# Altium project ESP32_DevKit.PrjPcb
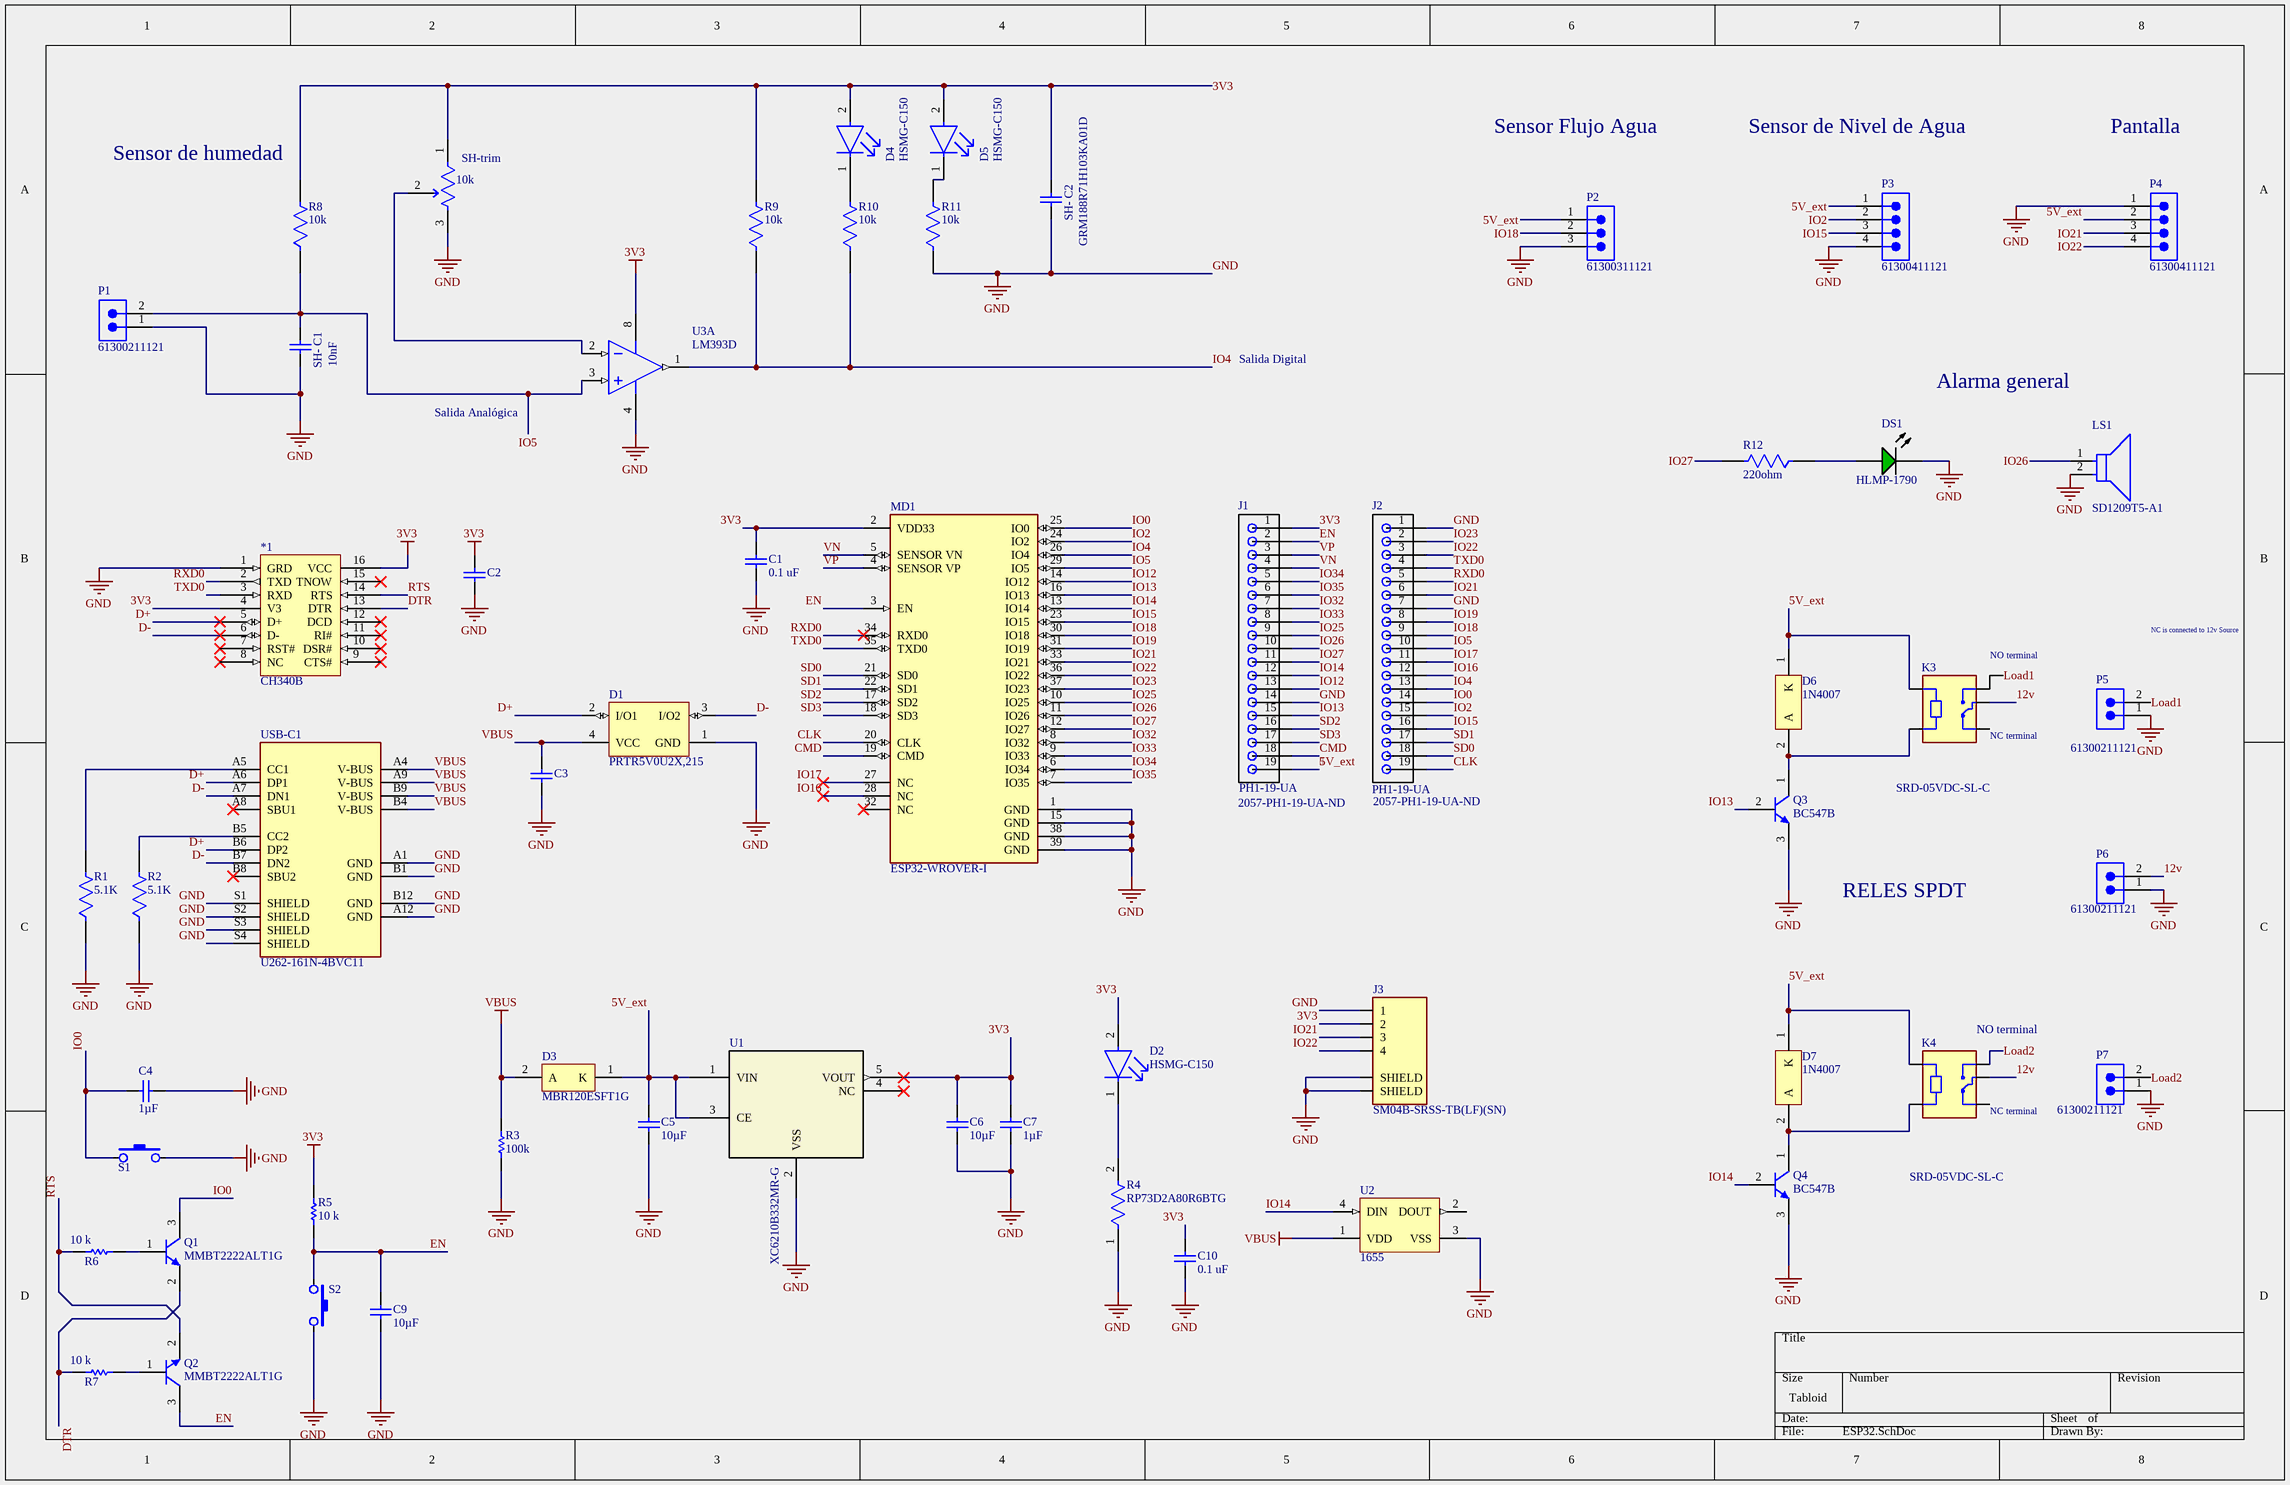
[diagram p0: ESP32.SchDoc]
1 sheet, 57 parts. Net scope: global (net labels, ports and power ports of the same name join across sheets).
Board files: stencil.PcbDoc, PCB1-ESP.PcbDoc

## Sheet ESP32.SchDoc
size Tabloid; SheetNumber: 1; SheetTotal: 1

### Parts
*1  CH340B  [CH340B]
C1  0.1 uF  [CAPC2013X94X50ML20T25]
C2  08055C104KAT2A  [CAPC2013X94X50ML20T25]  (value not drawn)
C3  08055C104KAT2A  [CAPC2013X94X50ML20T25]  (value not drawn)
C4  1µF  [CAPC2013X145X50ML20T25]
C5  10µF  [CAPC2013X140X50ML20T25]
C6  10µF  [CAPC2013X140X50ML20T25]
C7  1µF  [CAPC2013X145X50ML20T25]
C9  10µF  [CAPC2013X145X50ML20T25]
C10  0.1 uF  [CAPC2013X94X50ML20T25]
D1  PRTR5V0U2X,215  [NXP-SOT143B-4_V]
D2  HSMG-C150  [FP-HSMG-C150-MFG]
D3  MBR120ESFT1G  [ONSC-SOD-123FL-2-498_V]
D4  HSMG-C150  [FP-HSMG-C150-MFG]
D5  HSMG-C150  [FP-HSMG-C150-MFG]
D6  1N4007  [ONSC-AXIAL_LEAD-2-59-10_P]
D7  1N4007  [ONSC-AXIAL_LEAD-2-59-10_P]
DS1  HLMP-1790  [LED-2P-2.54-3MM_V]
J1  PH1-19-UA  Supplier Part Number 1: 2057-PH1-19-UA-ND  [PH1-19-UA]
J2  PH1-19-UA  Supplier Part Number 1: 2057-PH1-19-UA-ND  [PH1-19-UA]
J3  SM04B-SRSS-TB(LF)(SN)  [JST_SM04B-SRSS-TB(LF)(SN)]
K3  SRD-05VDC-SL-C  [RELAY_SRD-05VDC-SL-C]
K4  SRD-05VDC-SL-C  [RELAY_SRD-05VDC-SL-C]
LS1  SD1209T5-A1  [FP-SD1209-MFG]
MD1  ESP32-WROVER-I  [FP-ESP32-WROVER-I-MFG]
P1  61300211121  [61300211121]
P2  61300311121  [61300311121]
P3  61300411121  [61300411121]
P4  61300411121  [61300411121]
P5  61300211121  [61300211121]
P6  61300211121  [61300211121]
P7  61300211121  [61300211121]
Q1  MMBT2222ALT1G  [ONSC-SOT-23-3-318-08_V]
Q2  MMBT2222ALT1G  [ONSC-SOT-23-3-318-08_V]
Q3  BC547B  [ONSC-TO-92-3-29-11]
Q4  BC547B  [ONSC-TO-92-3-29-11]
R1  5.1K  [FP-CRCW0805-e3-MFG]
R2  5.1K  [FP-CRCW0805-e3-MFG]
R3  100k  [RESC2013X60X40ML20T25]
R4  RP73D2A80R6BTG  [FP-RP732A-MFG]
R5  10 k  [RESC2013X60X30ML20T20]
R6  10 k  [RESC2013X60X30ML20T20]
R7  10 k  [RESC2013X60X30ML20T20]
R8  10k  [FP-CRCW0805-e3-MFG]
R9  10k  [FP-CRCW0805-e3-MFG]
R10  10k  [FP-CRCW0805-e3-MFG]
R11  10k  [FP-CRCW0805-e3-MFG]
R12  220ohm  [FP-CRCW0805-e3-MFG]
S1  IO0  [SMT_SW_PTS_820]  (value not drawn)
S2  PTS820J25MSMTRLFS  [SMT_SW_PTS_820]  (value not drawn)
SH-_C1  10nF  [CAPC1608X90X35ML10T15]
SH-_C2  GRM188R71H103KA01D  [CAPC1608X90X35ML10T15]
SH-trim  10k  [FP-3362P-1-102TLF-MFG]
U1  XC6210B332MR-G  [SOT-25_TOR-M]
U2  1655  [ADA-RGB-1655_V]
U3  LM393D  [D0008A_M]  (part A of 2)
USB-C1  U262-161N-4BVC11  [U262-161N-4BVC11]

### Nets
3V3: *1.4(V3) *1.16(VCC) C1.2 C2.2 C6.2 C7.2 C10.2 D2.2(A) D4.2(A) D5.2(A) J1.1 J3.2 MD1.2(VDD33) R5.2 R8.2 R9.2 SH-_C2.2 SH-trim.1(CCW) U1.5(VOUT) U3.8(VCC)
GND: *1.1(GRD) C1.1 C2.1 C3.1 C4.1 C5.1 C6.1 C7.1 C9.1 C10.1 D1.1(GND) DS1.2(K) J1.14 J2.1 J2.7 J3.1 J3.S1(SHIELD) J3.S2(SHIELD) LS1.2(A) MD1.1(GND) MD1.15(GND) MD1.38(GND) MD1.39(GND) P1.1 P2.3 P3.4 P4.1 P5.1 P6.1 P7.1 Q3.3(E) Q4.3(E) R1.1 R2.1 R3.1 R4.1 R11.1 S1.2 S2.2 SH-_C1.1 SH-_C2.1 SH-trim.3(CW) U1.2(VSS) U2.3(VSS) U3.4(GND) USB-C1.A1(GND) USB-C1.A12(GND) USB-C1.B1(GND) USB-C1.B12(GND) USB-C1.S1(SHIELD) USB-C1.S2(SHIELD) USB-C1.S3(SHIELD) USB-C1.S4(SHIELD)
VBUS: C3.2 D1.4(VCC) D3.2(A) R3.2 U2.1(VDD) USB-C1.A4(V-BUS) USB-C1.A9(V-BUS) USB-C1.B4(V-BUS) USB-C1.B9(V-BUS)
12v: K3.COM K4.COM P6.2
: C5.2 D3.1(K) D6.1(K) D7.1(K) J1.19 K3.A1 K4.A1 P2.1 P3.1 P4.2 U1.1(VIN) U1.3(CE)  [also labelled 5V_ext]
CLK: J2.19 MD1.20(CLK)
CMD: J1.18 MD1.19(CMD)
D+: *1.5(D+) D1.2(I/O1) USB-C1.A6(DP1) USB-C1.B6(DP2)
D-: *1.6(D-) D1.3(I/O2) USB-C1.A7(DN1) USB-C1.B7(DN2)
DTR: *1.13(DTR) Q1.2(E) R7.2
EN: C9.2 J1.2 MD1.3(EN) Q2.3(C) R5.1 S2.1
IO0: C4.2 J2.14 MD1.25(IO0) Q1.3(C) S1.1
IO2: J2.15 MD1.24(IO2) P3.2
IO4: J2.13 MD1.26(IO4) R9.1 R10.1 U3.1(1OUT)
IO5: J2.10 MD1.29(IO5) P1.2 R8.1 SH-_C1.2 U3.3(1IN+)
IO12: J1.13 MD1.14(IO12)
IO13: J1.15 MD1.16(IO13) Q3.2(B)
IO14: J1.12 MD1.13(IO14) Q4.2(B) U2.4(DIN)
IO15: J2.16 MD1.23(IO15) P3.3
IO16: J2.12 MD1.28(NC)
IO17: J2.11 MD1.27(NC)
IO18: J2.9 MD1.30(IO18) P2.2
IO19: J2.8 MD1.31(IO19)
IO21: J2.6 J3.3 MD1.33(IO21) P4.3
IO22: J2.3 J3.4 MD1.36(IO22) P4.4
IO23: J2.2 MD1.37(IO23)
IO25: J1.9 MD1.10(IO25)
IO26: J1.10 LS1.1(C) MD1.11(IO26)
IO27: J1.11 MD1.12(IO27) R12.2
IO32: J1.7 MD1.8(IO32)
IO33: J1.8 MD1.9(IO33)
IO34: J1.5 MD1.6(IO34)
IO35: J1.6 MD1.7(IO35)
Load1: K3.NO P5.2
Load2: K4.NO P7.2
RTS: *1.14(RTS) Q2.2(E) R6.2
RXD0: *1.2(TXD) J2.5 MD1.34(RXD0)
SD0: J2.18 MD1.21(SD0)
SD1: J2.17 MD1.22(SD1)
SD2: J1.16 MD1.17(SD2)
SD3: J1.17 MD1.18(SD3)
TXD0: *1.3(RXD) J2.4 MD1.35(TXD0)
VN: J1.4 MD1.5(SENSOR_VN)
VP: J1.3 MD1.4(SENSOR_VP)
NetD2_1: D2.1(C) R4.2
NetD4_1: D4.1(C) R10.2
NetD5_1: D5.1(C) R11.2
NetD6_2: D6.2(A) K3.A2 Q3.1(C)
NetD7_2: D7.2(A) K4.A2 Q4.1(C)
NetDS1_1: DS1.1(A) R12.1
NetQ1_1: Q1.1(B) R6.1
NetQ2_1: Q2.1(B) R7.1
NetR1_2: R1.2 USB-C1.A5(CC1)
NetR2_2: R2.2 USB-C1.B5(CC2)
NetSH-trim_2: SH-trim.2(WIPER) U3.2(1IN-)

Not connected (* = marked no-connect by the designer): *1 7(RST#)* 8(NC)* 9(CTS#)* 10(DSR#)* 11(RI#)* 12(DCD)* 15(TNOW)*; K3 NC; K4 NC; MD1 32(NC)*; U1 4(NC)*; U2 2(DOUT); USB-C1 A8(SBU1)* B8(SBU2)*

### Notes on the sheet
- (near R8) Sensor de humedad
- Sensor Flujo Agua
- Sensor de Nivel de Agua
- Pantalla
- Salida Digital
- Salida Analógica
- Alarma general
- NC is connected to 12v Source
- (near K3) NO terminal
- (near K3) NC terminal
- RELES SPDT
- (near K4) NO terminal
- (near K4) NC terminal

### Library data of the parts
*1 = CH340B: - USB 2.0 Transceiver 2Mbps SOP-16_150mil USB ICs ROHS; ComponentLink1Description: Datasheet; ComponentLink1URL: https://www.mpja.com/download/35227cpdata.pdf
C1-C3 C10 = CMP-2000-05016-1: Chip Capacitor, Ceramic, 0.1 uF, 10%, 50 V, 0805, RoHS, Tape and Reel; Manufacturer: AVX; Rated Voltage: 50V; Capacitance: 100nF; Dielectric: X7R; Case Size/Dimension: 0805; Tolerance (%): ±10%; Datasheet URL: http://www.farnell.com/datasheets/319609.pdf; Datasheet Version: Sep-07; Manufacturer URL: http://www.avx.com/
C4 C7 C9 = CMP-2007-01082-1: 1µF ±10% 16V Ceramic Capacitor X7R 0805 (2012 Metric); Manufacturer: Kemet; Part Number: C0805C105K4RAC7800
C5 C6 = CMP-2007-03242-1: 10µF ±10% 16V Ceramic Capacitor X5R 0805 (2012 Metric); Part Number: CL21A106KOQNNNG
D1 = CMP-2000-05285-1: Ultra Low Capacitance Double Rail-to-Rail ESD Protection Diode, 5.5 V, 1 pF, -40 to 85 degC, 4-Pin SOT143B, RoHS, Tape and Reel; Manufacturer: NXP Semiconductors; Capacitance Value: 16pF; Number of Elements: 1; Rad Hardened: No; Reverse Breakdown Voltage: 6V; Working Voltage (Max): 5.5V; Polarity: Uni-Directional; Configuration: Quad; Leakage Current: 0.1uA; Product Height (mm): 1mm; Suppressor Type: DiodeArrays; Product Length (mm): 3mm; Product Depth (mm): 1.4mm; ESD Protection Voltage: 8KV@ContactDisc; Package Type: SOT; Mounting: SurfaceMount; Packaging: TapeandReel; Datasheet Version: Rev. 02, 01/2008; Reverse Stand-off Voltage: 5.5V; Manufacturer URL: http://www.nxp.com/; Operating Temp Range: -40Cto85C; Operating Temperature Classification: Industrial; Working Voltage: 5.5V; Operating Temperature Min Deg. C: -40C; Datasheet URL: https://datasheet.ciiva.com/4479/prtr5v0u2x-102853-4479461.pdf; Leakage Current (Max): 0.1uA; Direction Type: Uni-Directional; Pin Count: 3+Tab; Operating Temperature Max Deg. C: 85C; Mounting Style: SurfaceMount; Package / Case: SOT
D2 D4 D5 = CMP-2000-05061-2: LED GREEN DIFFUSED 1206 SMD; Manufacturer: Broadcom; Led Orientation: Top View; Max Junction Temp: +95°C; Peak Emmision Wavelength: 570nm; Viewing Angle: 170°; Wavelength: 572nm; Reverse Voltage: 5V; Luminous Intensity: 15mcd; Forward Voltage: 2.2V; Power Dissipation: 65mW; Forward Current: 20mA; ComponentLink2Description: Datasheet; Lead Free: Yes; Temperature Range Low: -40°C; Package: HSMG-C150; Digikey Description: LED GREEN DIFFUSED 1206 SMD; Mouser Description: LED Uni-Color Green 570nm 2-Pin Chip LED T/R; Manufacturer Part Number: HSMG-C150; Temperature Range High: +85°C; Device Class L1: Optoelectronics; Colour: Green; Category: Diode; Device Class L3: unset; RoHS: TRUE; Height: 1.2mm; ComponentLink2URL: https://docs.broadcom.com/docs/AV02-0551EN; Device Class L2: LEDs; Automotive: No; Ipc Land Pattern Name: DIOCP320160X55; Octopart: https://octopart.com/hsmg-c150-broadcom-71131304; Temperature: -40°C to +85°C
D3 = CMP-1055-00434-1: Schottky Power Rectifier, 2-Pin SOD-123, Pb-Free, Tape and Reel; Manufacturer: On Semiconductor; Configuration: Single; IFSM Max (A): 40; ComponentLink2URL: http://www.onsemi.cn/pub_link/Collateral/MBR120ESFT1-D.PDF; PackageDescription: 2-Pin SOD, Body 1.65 x 2.7 mm; RoHS: TRUE; ComponentLink1URL: http://www.onsemi.com/; PackageVersion: Rev. D, 05/2013; PartNumber: MBR120ESFT1G; PackageReference: SOD-123FL-2-498; ComponentLink2Description: Datasheet; ComponentLink1Description: Manufacturer URL; DatasheetVersion: Rev. 4; ComponentLink3Description: Package Specification; ComponentLink3URL: http://www.onsemi.com/pub_link/Collateral/498-01.PDF; Mounting Technology: Surface Mount; Packing: Tape and Reel
D6 D7 = CMP-0902-00142-1: Standard Recovery Rectifier, 2-Pin Axial_Lead, Pb-Free, Bulk Bag; Manufacturer: On Semiconductor; IO(rec) Max (A): 1; IFSM Max (A): 30; VRRM Max (V): 1000; ComponentLink3URL: http://www.onsemi.cn/pub_link/Collateral/59-10.PDF; PackageVersion: Rev. U, 02/2005; PackageDescription: 2-Pin, Axial Lead, Diameter 2.35 mm; PackageReference: AXIAL_LEAD-2-59-10; RoHS: TRUE; PartNumber: 1N4007; Packing: Bulk Bag; DatasheetVersion: Rev. 13; ComponentLink3Description: Package Specification; ComponentLink1Description: Manufacturer URL; ComponentLink2URL: http://www.onsemi.com/pub_link/Collateral/1N4001-D.PDF; ComponentLink1URL: http://www.onsemi.com/; Type: Standard Recovery; ComponentLink2Description: Datasheet; Mounting Technology: Through Hole
DS1 = CMP-2000-05186-1: LED, Green, 2 mA, 1.9 V, -20 to 100 degC, 2-Pin THD, RoHS, Bulk; Manufacturer: Avago; Viewing Angle: 50deg; Number of LEDs: 1; Lens Appearance: ColoredDiffused; Peak Wavelength: 565nm; Dominant Wavelength/Color Temperature: 569nm; Mounting Orientation: TopMount; Rad Hard: No; Lens Shape Type: Circular; Type: Uni-Color; Intensity: 2.3mcd; Package: 2T-1; Packaging: Bulk; Pin Count: 2; Color: Green; Datasheet URL: https://datasheet.ciiva.com/11773/0900766b800204ad-11773539.pdf; Manufacturer URL: http://www.avagotech.com/; Category: LEDs; Mounting: ThroughHole; Datasheet Version: Jul-14
J1 J2 = PH1-19-UA: Connector Header Through Hole 19 position 0.100" (2.54mm); Supplier 1: Digi-Key
J3 = SM04B-SRSS-TB(LF)(SN): Connector Header Surface Mount, Right Angle 4 position 0.039 _1.00mm_; MF: JST Sales; MP: SM04B-SRSS-TB_LF__SN_; Price: None; SnapEDA_Link: https://www.snapeda.com/parts/SM04B-SRSS-TB%28LF%29%28SN%29/JST%20Sales%20America%20Inc./view-part/557466/?ref=snap; Value: *; Availability: Unavailable; Package: None
K3 K4 = SRD-05VDC-SL-C: 5V Trigger Relay Module For Arduino And Raspberry Pi 5V Trigger Relay Module For Arduino And Raspberry Pi; MF: Songle Relay; Check_prices: https://www.snapeda.com/parts/SRD-05VDC-SL-C/Songle+Relay/view-part/?ref=eda; Value: *; Availability: Not in stock; Price: None; Package: NON STANDARD-5 Songle Relay; MP: SRD-05VDC-SL-C; SnapEDA_Link: https://www.snapeda.com/parts/SRD-05VDC-SL-C/Songle+Relay/view-part/?ref=snap
LS1 = CMP-08413-000009-1: AUDIO MAGNETIC XDCR 3-6V TH; Max Supply Current: 60mA; Number of Terminals/Pins: 2; Frequency: 2.048kHz; Washable: No; Operating Supply Voltage: 5V; Self Resonant Frequency: 2.05kHz; Min Operating Temperature: -40°C; Operating Supply Current: 60mA; Diameter: 12mm; Package Quantity: 100; Max Operating Temperature: 85°C; Sensing Method: Magnetic; Series: SD; Current Rating: 60mA; Lead Free: Lead Free; Height: 9mm; Packaging: Tray; Termination: PC Pins; Number of Pins: 2; Voltage Rating (DC): 5V; Mount: Through Hole
MD1 = CMP-194065-000001-1: SMD MODULE, ESP32-D0WDQ6, 32MBIT; Manufacturer: Espressif; Number Of Adc Channels: 16; Min Supply Voltage: 2.3V; Interface: I2C,SPI,UART,I2S,Other; Max Frequency: 2484MHz; Nominal Supply Current: 500mA; Sensitivity: -98dBm; Max Supply Voltage: 3.6V; Number Of Gpio: 20; Data Rate: 150Mbits/s; Package: ESP32-WROVER-I; Temperature Range Low: -40°C; Temperature Range High: +85°C; Device Class L1: Integrated Circuits (ICs); Category: UNK; ComponentLink2Description: Datasheet; Device Class L2: RF Semiconductors and Devices; Automotive: No; Lead Free: Yes; Octopart: https://octopart.com/esp32-wrover-i-espressif+systems-89171349; ComponentLink2URL: https://www.espressif.com/sites/default/files/documentation/esp32-wrover_datasheet_en.pdf; Temperature: -40°C to +85°C; Height: 3.4mm; RoHS: TRUE; Digikey Description: SMD MODULE, ESP32-D0WDQ6, 32MBIT; Device Class L3: Transceivers; Manufacturer Part Number: ESP32-WROVER-I
P1 P5-P7 = CMP-1712-00002-6: NexarPartId: 20081794; Number of Contacts: 2; Pitch: 2.54mm; Connector Type: Male Pin; Voltage Rating: 250V; Current Rating: 3A; Gender: Male; Contact Resistance: 20mΩ; Height: 8.94mm; Lead Free: Lead Free; Number of Pins: 2; Termination: Through Hole; RoHS: Compliant; Lead Pitch: 2.54mm; REACH SVHC: No SVHC; Housing Material: PBT; Contact Mating Length: 5.9944mm; Min Operating Temperature: -40°C; Orientation: Vertical; Contact Material: Copper; Contact Gender: Male; Max Operating Temperature: 125°C; Number of Rows: 1; Number of Positions: 2; Packaging: Bulk; Contact Plating: Gold; Mount: Through Hole; Color: Black; Operating Supply Voltage: 250V
P2 = CMP-1502-01062-3: NexarPartId: 32855521; Current Rating: 3A; Voltage Rating: 250V; Number of Positions: 3; Pitch: 2.54mm; Contact Resistance: 20mΩ; Connector Type: Male Pin; Gender: Male; REACH SVHC: Unknown; Packaging: Bulk; Contact Material: Copper; Min Operating Temperature: -40°C; Number of Rows: 1; Orientation: Vertical; RoHS: Compliant; Contact Plating: Gold; Max Operating Temperature: 105°C; Mount: Through Hole; Height: 8.94mm; Operating Supply Voltage: 250V; Number of Pins: 3; Contact Mating Length: 5.9944mm; Number of Contacts: 3; Color: Black; Lead Free: Lead Free; Lead Pitch: 2.54mm; Termination: Solder
P3 P4 = CMP-1502-01064-3: NexarPartId: 32855522; Operating Supply Voltage: 250V; Pitch: 2.54mm; Contact Resistance: 20mΩ; Number of Positions: 4; Current Rating: 3A; Connector Type: Male Pin; Gender: Male; Contact Plating: Gold; Height: 8.89mm; Lead Pitch: 2.54mm; Lead Free: Lead Free; Contact Mating Length: 5.9944mm; Number of Rows: 1; Termination: Solder; Packaging: Bulk; REACH SVHC: Unknown; Min Operating Temperature: -40°C; RoHS: Compliant; Number of Contacts: 4; Voltage Rating: 250V; Color: Black; Max Operating Temperature: 105°C; Contact Material: Copper; Mount: Through Hole; Orientation: Vertical; Number of Pins: 4
Q1 Q2 = CMP-1048-00538-1: General Purpose Transistor, NPN Silicon, 3-Pin SOT-23, Pb-Free, Tape and Reel; Manufacturer: On Semiconductor; fT Min (MHz): 300; IC Continuous (A): 0.6; ComponentLink3URL: http://www.onsemi.cn/pub_link/Collateral/318-08.PDF; PartNumber: MMBT2222ALT1G; RoHS: TRUE; ComponentLink1URL: http://www.onsemi.com/; ComponentLink3Description: Package Specification; ComponentLink2Description: Datasheet; Mounting Technology: Surface Mount; Packing: Tape and Reel; PackageDescription: 3-Pin Small Outline Transistor, Body 2.92 x 1.3 mm, Pitch 0.95 mm; DatasheetVersion: Rev. 10; PackageReference: SOT-23-3-318-08; ComponentLink2URL: http://www.onsemi.cn/pub_link/Collateral/MMBT2222LT1-D.PDF; Polarity: NPN; PackageVersion: Rev. AP, 11/2009; ComponentLink1Description: Manufacturer URL
Q3 Q4 = CMP-1048-01467-1: Amplifier Transistor, NPN Silicon, 3-Pin TO-92, Bulk Box; Manufacturer: On Semiconductor; IC Continuous (A): 0.1; fT Min (MHz): 150; DatasheetVersion: Rev. 7; ComponentLink1URL: http://www.onsemi.com/; Polarity: NPN; RoHS: FALSE; ComponentLink1Description: Manufacturer URL; Packing: Bulk Box; PackageDescription: 3-Pin Transistor Outline, Body 4.825 x 3.685 mm, Pitch 1.27 mm; ComponentLink3URL: http://www.onsemi.cn/pub_link/Collateral/2N6426-D.PDF; ComponentLink2Description: Datasheet; PackageVersion: Rev. AM; PackageReference: TO-92-3-29-11_AM_SL; ComponentLink3Description: Package Specification; Mounting Technology: Through Hole; PartNumber: BC547B; ComponentLink2URL: http://www.onsemi.com/pub_link/Collateral/BC546-D.PDF
R1 R2 R8-R12 = CMP-2001-04024-2: RES Thick Film, 5.1kΩ, 1%, 0.125W, 100ppm/°C, 0805; Power Rating: 125mW; Voltage Rating (DC): 150V; Resistance: 5.1kR; Packaging: Tape and Reel; Case Code (Metric): 2012; Contact Plating: Tin; Case Code (Imperial): 0805; Depth: 1.25mm; Tolerance: 1%; Width: 0.049inch; Temperature Coefficient: 100ppm/°C; Max Power Dissipation: 125mW; Military Standard: Not; Lead Free: Lead Free; Mount: Surface Mount; Min Operating Temperature: -55°C; Package Quantity: 10; Weight: 0.000194oz; Height: 0.45mm; Number of Terminations: 2; Max Operating Temperature: 155°C; Termination: SMD/SMT; Case/Package: 0805; Composition: Thick Film; Voltage Rating: 150V; Length: 2mm; Features: Automotive AEC-Q200; Radiation Hardening: No
R3 = CMP-2001-00583-1: 100 kOhms ±0.1% 0.125W, 1/8W Chip Resistor 0805 (2012 Metric) Automotive AEC-Q200 Thin Film; Part Number: ERA6AEB104V; Manufacturer: Panasonic
R4 = CMP-03211-002377-1: RESISTOR, 0805 80.6Ω, 0.1% 15ppm/°C; Manufacturer: TE Connectivity; Power Rating: 0.125W; Voltage Rating: 150V; ComponentLink2URL: https://www.te.com/commerce/DocumentDelivery/DDEController?Action=srchrtrv&DocNm=1773272&DocType=DS&DocLang=English; Device Class L3: Chip SMD Resistors; Automotive: No; ComponentLink2Description: Datasheet; Series: RP73; Temperature Coefficient: 15ppm/°C; Octopart: https://octopart.com/rp73d2a80r6btg-te+connectivity-42011633; octopart_url: https://octopart.com/rp73d2a80r6btg-te+connectivity-42011633; Device Class L2: Resistors; Device Class L1: Passive Components; Value: 80.6Ω; Composition: Thin Film; Lead Free: Yes; Ipc Land Pattern Name: RESC200125X55; Resistance: 80.6Ω; Package: RP732A; packaging: 250 cut tape length; Height: 0.65mm; Tolerance: 0.1%; Manufacturer Part Number: RP73D2A80R6BTG; Temperature: -55°C to 155°C; Temperature Range High: 155°C; RoHS: TRUE; Category: Res; Temperature Range Low: -55°C
R5-R7 = CMP-2001-04657-1: 10 kOhms ±5% 0.25W, 1/4W Chip Resistor 0805 (2012 Metric) Automotive AEC-Q200, Moisture Resistant Thick Film; Part Number: RK73B2ATTD103J; Manufacturer: KOA Speer
S1 = PTS820J25MSMTRLFS
SH-_C1 = CMP-2100-03642-1: Chip Capacitor, 10 nF, +/- 10%, 50 V, -55 to 125 degC, 0603 (1608 Metric), RoHS, Tape and Reel; Manufacturer: Murata; Insulation Resistance: 10GR; Dielectric: X7R; Voltage Rating: 50V; Dielectric Material: Ceramic; Package Quantity: 1; Lead Free: LeadFree; Case/Package: 0603; Termination: SMD/SMT; REACH SVHC: Unknown; Manufacturer URL: http://www.murata.com/; Datasheet URL: http://search.murata.co.jp/Ceramy/image/img/A01X/G101/ENG/GRM188R71H103KA01-01.pdf; Mount: SurfaceMount; Datasheet Version: 42401.0; Number of Pins: 2; Length: 1.6mm; Voltage: 50V; Depth: 0.8mm; Tolerance: 10%; Min Operating Temperature: -55degC; Voltage Rating (DC): 50V; Max Operating Temperature: 125degC; Package Description: 2-Pin Surface Mount Device, Body 1.6 x 0.8 mm; RoHSCompliant: True; Case Code (Imperial): 0603; Width: 0.031inch; Case Code (Metric): 1608; Height: 0.8mm; Package Reference: 0603; Packaging: TapeandReel; Thickness: 0.035inch; Capacitance: 10nF; Material: Ceramic
SH-_C2 = CMP-2100-03642-1: Chip Capacitor, 10 nF, +/- 10%, 50 V, -55 to 125 degC, 0603 (1608 Metric), RoHS, Tape and Reel; Manufacturer: Murata; Insulation Resistance: 10GR; Dielectric: X7R; Voltage Rating: 50V; Capacitance: 10nF; Dielectric Material: Ceramic; Package Quantity: 1; Lead Free: LeadFree; Case/Package: 0603; Termination: SMD/SMT; REACH SVHC: Unknown; Manufacturer URL: http://www.murata.com/; Datasheet URL: http://search.murata.co.jp/Ceramy/image/img/A01X/G101/ENG/GRM188R71H103KA01-01.pdf; Mount: SurfaceMount; Datasheet Version: 42401.0; Number of Pins: 2; Length: 1.6mm; Voltage: 50V; Depth: 0.8mm; Tolerance: 10%; Min Operating Temperature: -55degC; Voltage Rating (DC): 50V; Max Operating Temperature: 125degC; Package Description: 2-Pin Surface Mount Device, Body 1.6 x 0.8 mm; RoHSCompliant: True; Case Code (Imperial): 0603; Width: 0.031inch; Case Code (Metric): 1608; Height: 0.8mm; Package Reference: 0603; Packaging: TapeandReel; Thickness: 0.035inch; Material: Ceramic
SH-trim = CMP-07234-000030-1: 10k POT; Power Rating: 500mW; Tolerance: 10%; Resistance: 1kR; Number of Turns: 1; Temperature Coefficient: 100ppm/°C; Weight: 0.02oz; RoHS Compliant: Yes; Contact Plating: Tin; Mount: Through Hole; Max Operating Temperature: 125°C; Series: Trimpot® 3362 - Sealed; Packaging: Rail/Tube; Depth: 7.04mm; Resistor Type: Cermet; Length: 6.71mm; Width: 4.7mm; Max Power Dissipation: 500mW; Termination: Pin; Package Quantity: 200; Military Standard: Not; Technology: CERMET; Min Operating Temperature: -55°C; Height: 0.185inch
U1 = XC6210B332MR-G: No Description Available; Mfr_Name: Torex Semiconductor; Copyright: Copyright (C) 2022 Ultra Librarian. All rights reserved.; Manufacturer_Part_Number: XC6210B332MR-G; RefDes: RefDes; Type: DEV
U2 = CMP-2000-05026-1: Intelligent Control LED Integrated Light Source, 3.5 to 5.3 V, -25 to 80 degC, 4-Pin SMD, RoHS, Tape and Reel; Manufacturer: Adafruit-Industries-LLC; Number of LEDs: 10; Configuration: Discrete; Utilized LED: WS2812(5050); Datasheet URL: http://datasheet.octopart.com/ADA1655-Adafruit-Industries-datasheet-32028139.pdf; Series: Neopixel; Interface: -; Package Description: 4-Pin Surface Mount Device, Body 5 x 5 mm; Color: Red,Green,Blue(RGB); Category: Optoelectronics; Controller Type: -; Package Reference: 1655; Manufacturer URL: https://www.adafruit.com/; Mounting Type: SurfaceMount; Datasheet Version: May-13; Size / Dimension: 5.00mmLx5.00mmW; Family: Addressable,Specialty
U3 = CMP-2000-04951-1: Dual Differential Comparator, 2 to 30 V, 0 to 70 degC, 8-pin SOIC (D8), Green (RoHS & no Sb/Br); Manufacturer: TexasInstruments; Maximum Single Supply Voltage: 36V; Typical Response Time: 1.3us; Maximum Dual Supply Voltage: ±18V; Minimum Dual Supply Voltage: ±1V; Output Type: OpenCollector; Minimum Single Supply Voltage: 2V; Number of Channels per Chip: 2; Typical Voltage Gain: 106.02dB; Category: Comparator; Rail to Rail: No; Mounting: SurfaceMount; Package URL: http://www.ti.com/lit/ml/msoi002j/msoi002j.pdf; Strobe Capability: No; Package Reference: D8; Datasheet URL: https://datasheet.ciiva.com/15131/getdatasheetpartid-248499-15131100.pdf; Package: 8SOIC; Manufacturer URL: http://www.ti.com/; Datasheet Version: Rev. W, 07/2010; Rad Hard: No; Packaging: Rail/Tube; Package Description: 8-Pin Small Outline Integrated Circuit, Body 4.9 x 3.9 mm, Pitch 1.27 mm; Operating Temperature: 0to70degC
USB-C1 = U262-161N-4BVC11: USB - Type C Female 16 SMT USB Connectors RoHS; ComponentLink1Description: datasheet; ComponentLink1URL: https://datasheet.lcsc.com/szlcsc/2002271811_XKB-Connectivity-U262-161N-4BVC11_C319148.pdf; ComponentLink2Description: LCSC Link; ComponentLink2URL: https://lcsc.com/product-detail/USB-Connectors_XKB-Connectivity-U262-161N-4BVC11_C319148.html